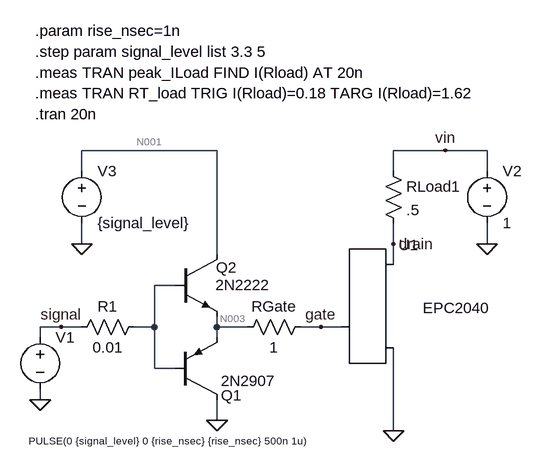
[diagram p0: schematic 02-epc2040.asc]
02-epc2040.asc, the LTspice schematic file:
Version 4
SHEET 1 880 680
WIRE -64 -208 -272 -208
WIRE 288 -208 208 -208
WIRE 352 -208 288 -208
WIRE -272 -176 -272 -208
WIRE 208 -176 208 -208
WIRE 352 -176 352 -208
WIRE -272 -64 -272 -96
WIRE 208 -64 208 -96
WIRE 352 -64 352 -96
WIRE -64 -48 -64 -208
WIRE 208 -32 208 -64
WIRE -128 0 -160 0
WIRE -304 64 -336 64
WIRE -272 64 -304 64
WIRE -160 64 -160 0
WIRE -160 64 -192 64
WIRE -64 64 -64 48
WIRE -16 64 -64 64
WIRE 96 64 64 64
WIRE 128 64 96 64
WIRE -336 80 -336 64
WIRE -64 80 -64 64
WIRE -160 128 -160 64
WIRE -128 128 -160 128
WIRE -336 176 -336 160
WIRE -64 208 -64 176
WIRE 208 224 208 96
FLAG 208 224 0
FLAG -336 176 0
FLAG 352 -64 0
FLAG 288 -208 vin
FLAG 208 -64 drain
FLAG 96 64 gate
FLAG -304 64 signal
FLAG -272 -64 0
FLAG -64 208 0
SYMBOL EPCGaN 128 64 R0
WINDOW 3 125 -29 Left 2
SYMATTR Value EPC2040
SYMATTR InstName U1
SYMBOL res 80 48 R90
WINDOW 0 0 56 VBottom 2
WINDOW 3 32 56 VTop 2
SYMATTR InstName RGate
SYMATTR Value 1
SYMBOL voltage -336 64 R0
WINDOW 3 -18 175 Left 1
WINDOW 123 0 0 Left 0
WINDOW 39 0 0 Left 0
SYMATTR Value PULSE(0 {signal_level} 0 {rise_nsec} {rise_nsec} 500n 1u)
SYMATTR InstName V1
SYMBOL res 192 -192 R0
SYMATTR InstName RLoad1
SYMATTR Value .5
SYMBOL voltage 352 -192 R0
WINDOW 123 0 0 Left 0
WINDOW 39 0 0 Left 0
SYMATTR InstName V2
SYMATTR Value 1
SYMBOL pnp -128 176 M180
WINDOW 0 70 7 Left 2
WINDOW 3 70 29 Left 2
SYMATTR InstName Q1
SYMATTR Value 2N2907
SYMBOL npn -128 -48 R0
WINDOW 0 63 20 Left 2
WINDOW 3 62 47 Left 2
SYMATTR InstName Q2
SYMATTR Value 2N2222
SYMBOL voltage -272 -192 R0
WINDOW 123 0 0 Left 0
WINDOW 39 0 0 Left 0
SYMATTR InstName V3
SYMATTR Value {signal_level}
SYMBOL res -176 48 R90
WINDOW 0 0 56 VBottom 2
WINDOW 3 32 56 VTop 2
SYMATTR InstName R1
SYMATTR Value 0.01
TEXT -344 -264 Left 2 !.tran 20n
TEXT -344 -392 Left 2 !.param rise_nsec=1n
TEXT -344 -360 Left 2 !.step param signal_level list 3.3 5
TEXT -344 -328 Left 2 !.meas TRAN peak_ILoad FIND I(Rload) AT 20n
TEXT -344 -296 Left 2 !.meas TRAN RT_load TRIG I(Rload)=0.18 TARG I(Rload)=1.62

The netlist it stands for:
* 02-epc2040.asc
XU1 gate drain 0 EPC2040
RGate gate N003 1
V1 signal 0 PULSE(0 {signal_level} 0 {rise_nsec} {rise_nsec} 500n 1u)
RLoad1 vin drain .5
V2 vin 0 1
Q1 0 N002 N003 0 2N2907
Q2 N001 N002 N003 0 2N2222
V3 N001 0 {signal_level}
R1 N002 signal 0.01
.model NPN NPN
.model PNP PNP
.lib standard.bjt
.tran 20n
.param rise_nsec=1n
.step param signal_level list 3.3 5
.meas TRAN peak_ILoad FIND I(Rload) AT 20n
.meas TRAN RT_load TRIG I(Rload)=0.18 TARG I(Rload)=1.62
.backanno
.end

* Results of the author's LTspice run, read from the files saved beside the schematic
* Operating Point (first step), zero values left out:
*   signal_level = 3.3 
*   V(drain) = 1 V
*   V(gate) = 310.9 mV
*   V(n003) = 310.9 mV
*   V(vin) = 1 V
*   V(n001) = 3.3 V
*   Ic(Q1) = -1.658 nA
*   Ib(Q1) = -6.941 pA
*   Ie(Q1) = 1.664 nA
*   Ic(Q2) = 3.304 pA
*   Ib(Q2) = -3.614 pA
*   I(Rgate) = 1.665 nA
*   I(Rload1) = 2.13 µA
*   I(R1) = 10.56 pA
*   I(V1) = 10.56 pA
*   I(V2) = -2.13 µA
*   I(V3) = -3.304 pA
*   Ix(u1:GATEIN) = -1.665 nA
*   Ix(u1:DRAININ) = 2.13 µA
*   Ix(u1:SOURCEIN) = -2.128 µA
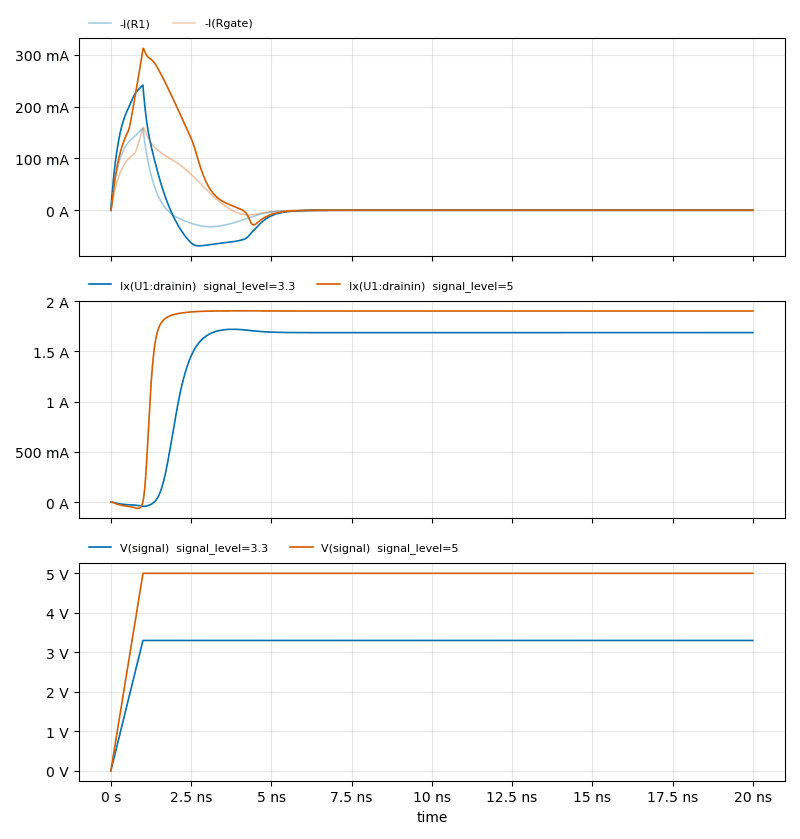
[diagram p1: Transient Analysis of 02-epc2040.asc, plotted from the saved traces]
* Transient Analysis, 2 runs:
*   -I(R1) [signal_level=3.3]: min -31.85 mA, max 158.3 mA, average 4.377 mA, rms 31.32 mA, last -4.172 µA
*   -I(R1) [signal_level=5]: min -68.74 mA, max 241.6 mA, average 4.528 mA, rms 51.44 mA, last 4.047 µA
*   -I(Rgate) [signal_level=3.3]: min -9.138 mA, max 160.6 mA, average 14.03 mA, rms 38.07 mA, last 11.19 µA
*   -I(Rgate) [signal_level=5]: min -28.04 mA, max 312.7 mA, average 27.85 mA, rms 78.29 mA, last 4.048 µA
*   Ix(U1:drainin) [signal_level=3.3]: min -43.06 mA, max 1.721 A, average 1.514 A, rms 1.591 A, last 1.688 A
*   Ix(U1:drainin) [signal_level=5]: min -62.82 mA, max 1.905 A, average 1.782 A, rms 1.837 A, last 1.903 A
*   V(signal) [signal_level=3.3]: min 0 V, max 3.3 V, average 3.217 V, rms 3.245 V, last 3.3 V
*   V(signal) [signal_level=5]: min 0 V, max 5 V, average 4.875 V, rms 4.916 V, last 5 V
* From the log:
*   Measurement "peak_iload" FAIL'ed
*   Measurement "rt_load" FAIL'ed